# EAGLE design ibus_adapter (EAGLE 5.10)
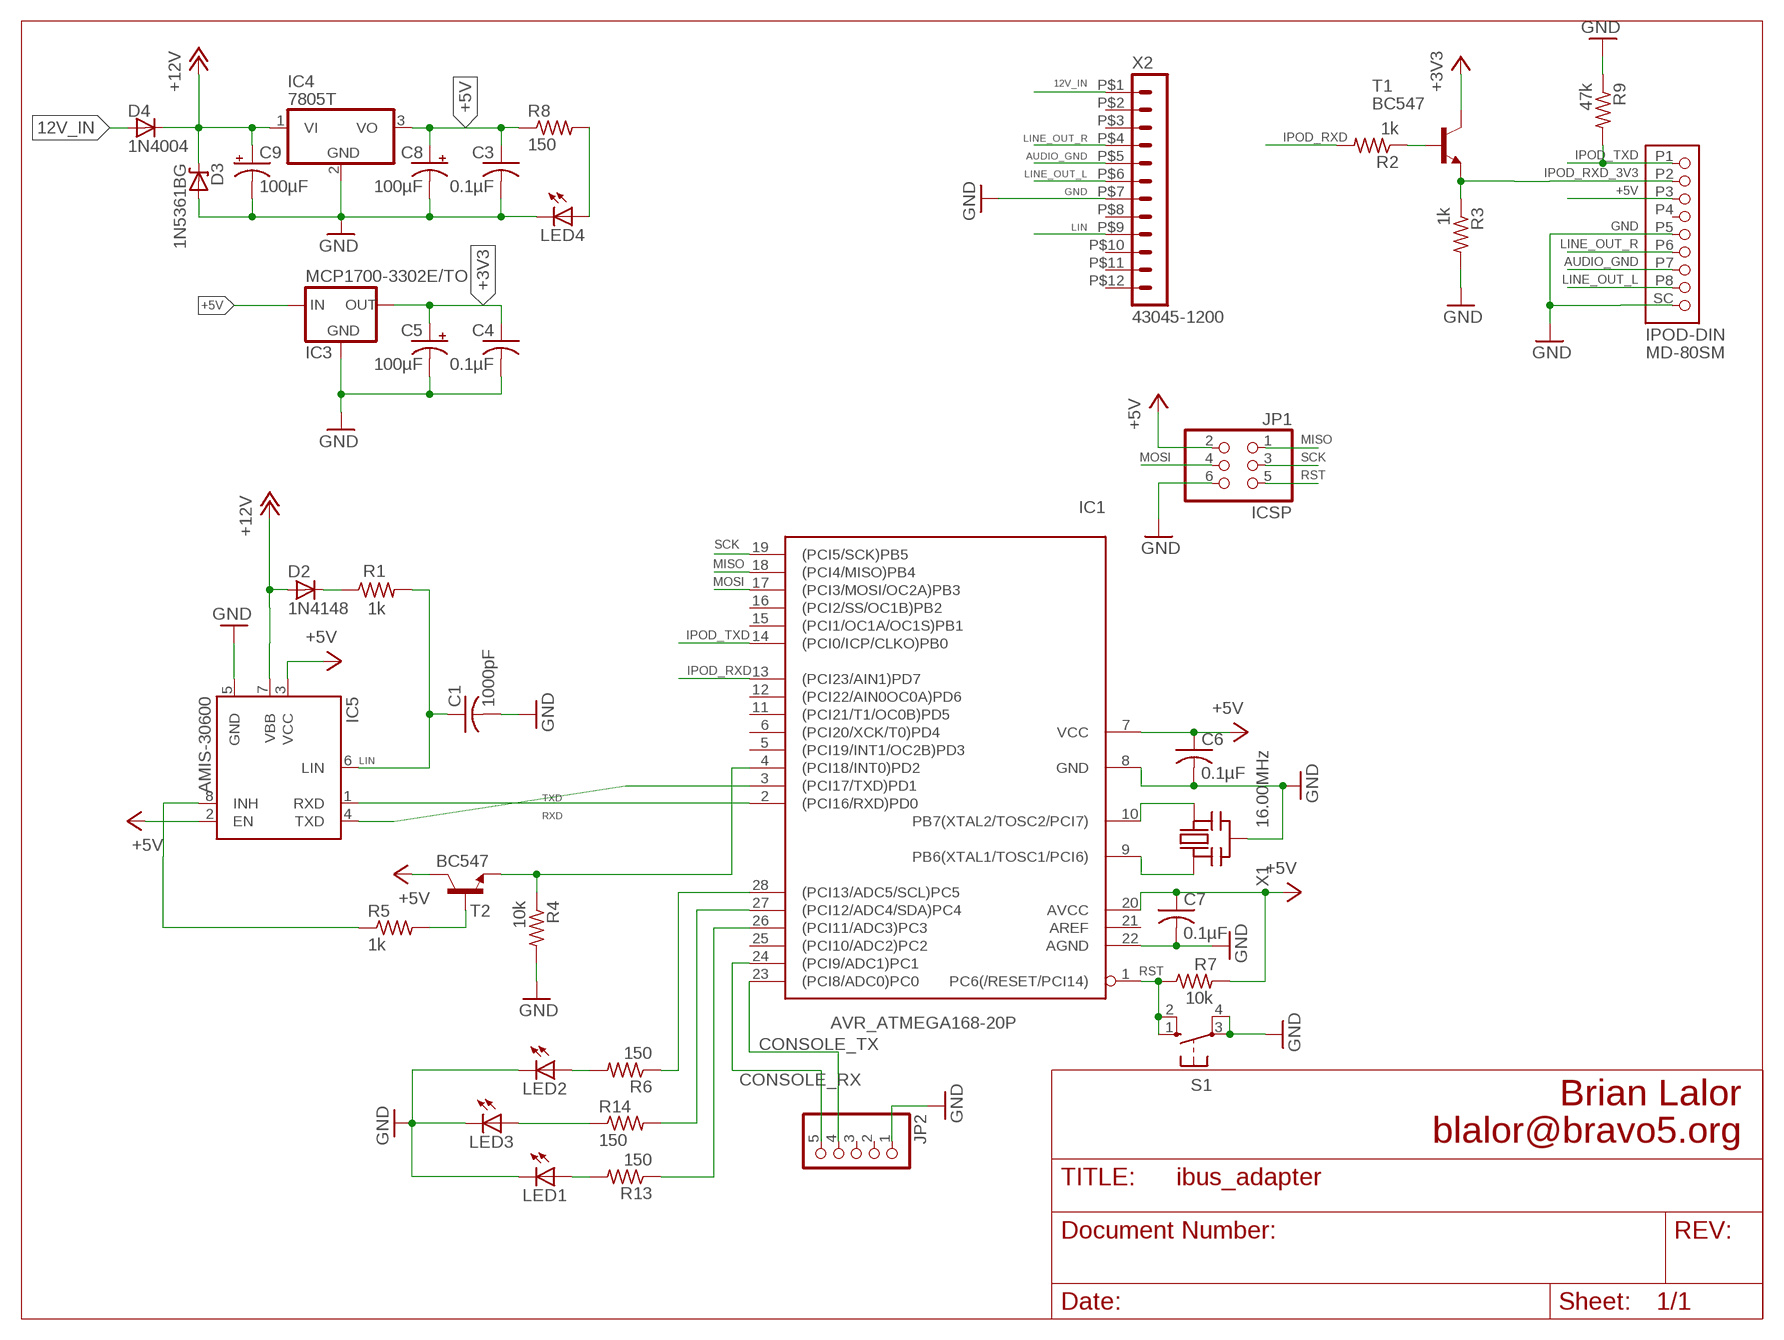
[diagram p0: schematic, sheet 1]

## Parts
C1  1000pF  C-US025-030X050  [C025-030X050]
C3  0.1µF  C-US025-025X050  [C025-025X050]
C4  0.1µF  C-US025-025X050  [C025-025X050]
C5  100µF  CPOL-USE2.5-5  [E2,5-5]
C6  0.1µF  C-US025-025X050  [C025-025X050]
C7  0.1µF  C-US025-025X050  [C025-025X050]
C8  100µF  CPOL-USE2.5-5  [E2,5-5]
C9  100µF  CPOL-USE3.5-8  [E3,5-8]
D2  1N4148  1N4148DO35-7  [DO35-7]
D3  1N5361BG  1N5365B  [SURMETIC_40]
D4  1N4004  [DO41-10]
IC1  AVR_ATMEGA168-20P  [AVR_DIL28-3]
IC3  MCP1700-3302E/TO  ULINK_MC1700  [ULINK_TO92]
IC4  7805T  [TO220H]
IC5  AMIS-30600  [SO-8]
IPOD-DIN  MD-80SM  MD-80SM(2)  [MD-80SM]
JP1  ICSP  PINHD-2X3  [2X03]
JP2  PINHD-1X5  [1X05]
LED1  LEDCHIP-LED0603  [CHIP-LED0603]
LED2  LEDCHIP-LED0603  [CHIP-LED0603]
LED3  LEDCHIP-LED0603  [CHIP-LED0603]
LED4  LEDCHIP-LED0603  [CHIP-LED0603]
R1  1k  R-US_0204/7  [0204/7]
R2  1k  R-US_0207/2V  [0207/2V]
R3  1k  R-US_0207/2V  [0207/2V]
R4  10k  R-US_0207/2V  [0207/2V]
R5  1k  R-US_0207/2V  [0207/2V]
R6  150  R-US_R0603  [R0603]
R7  10k  R-US_0207/10  [0207/10]
R8  150  R-US_R0603  [R0603]
R9  47k  R-US_0207/2V  [0207/2V]
R13  150  R-US_R0603  [R0603]
R14  150  R-US_R0603  [R0603]
S1  SWITCH-OMRON_10-XX  [SWITCH-OMRON_B3F-10XX]
T1  BC547  BC547A-NPN-TO92-EBC  [TO92-EBC]
T2  BC547  BC547A-NPN-TO92-EBC  [TO92-EBC]
X1  16.00MHz  DIGG_CERMOSCILL  [DIGG_CERM_OSC]
X2  43045-1200  HEADER_POS12_43045-1200  [43045-1200]

## Nets
12V_IN: D4.A X2.P$1
+3V3: C4.1 C5.+ IC3.3(OUT) T1.C
+5V: C3.1 C6.1 C7.1 C8.+ IC1.7(VCC) IC1.20(AVCC) IC3.2(IN) IC4.3(VO) IC5.2(EN) IC5.3(VCC) IPOD-DIN.P3 JP1.2 R7.2 R8.1 T2.C
+12V: C9.+ D2.A D3.K(C) D4.C IC4.1(VI) IC5.7(VBB)
AUDIO_GND: IPOD-DIN.P7 X2.P$5
CONSOLE_RX: IC1.24((PCI9/ADC1)PC1) JP2.5
CONSOLE_TX: IC1.23((PCI8/ADC0)PC0) JP2.4
GND: C1.2 C3.2 C4.2 C5.- C6.2 C7.2 C8.- C9.- D3.A IC1.8(GND) IC1.22(AGND) IC3.1(GND) IC4.2(GND) IC5.5(GND) IPOD-DIN.P5 IPOD-DIN.SC(SHIELD) JP1.6 JP2.1 LED1.C LED2.C LED3.C LED4.C R3.2 R4.2 R9.1 S1.3(P) S1.4(P1) X1.P$2(GND) X2.P$7
IPOD_RXD: IC1.13((PCI23/AIN1)PD7) R2.2
IPOD_RXD_3V3: IPOD-DIN.P2 R3.1 T1.E
IPOD_TXD: IC1.14((PCI0/ICP/CLKO)PB0) IPOD-DIN.P1 R9.2
LIN: C1.1 IC5.6(LIN) R1.2 X2.P$9
LIN_INH: IC1.4((PCI18/INT0)PD2) R4.1 T2.E
LINE_OUT_L: IPOD-DIN.P8 X2.P$6
LINE_OUT_R: IPOD-DIN.P6 X2.P$4
MISO: IC1.18((PCI4/MISO)PB4) JP1.1
MOSI: IC1.17((PCI3/MOSI/OC2A)PB3) JP1.4
N$1: IC1.10(PB7(XTAL2/TOSC2/PCI7)) X1.P$3(OUT)
N$2: IC1.28((PCI13/ADC5/SCL)PC5) R6.1
N$3: R5.2 T2.B
N$4: D2.C R1.1
N$5: R2.1 T1.B
N$6: IC5.8(INH) R5.1
N$7: IC1.27((PCI12/ADC4/SDA)PC4) R14.2
N$9: IC1.26((PCI11/ADC3)PC3) R13.1
N$10: LED3.A R14.1
N$11: IC1.9(PB6(XTAL1/TOSC1/PCI6)) X1.P$1(IN)
N$12: LED4.A R8.2
N$13: LED1.A R13.2
N$15: LED2.A R6.2
RST: IC1.1(PC6(/RESET/PCI14)) JP1.5 R7.1 S1.1(S) S1.2(S1)
RXD: IC1.2((PCI16/RXD)PD0) IC5.1(RXD)
SCK: IC1.19((PCI5/SCK)PB5) JP1.3
TXD: IC1.3((PCI17/TXD)PD1) IC5.4(TXD)
Unconnected: IC1.5((PCI19/INT1/OC2B)PD3) IC1.6((PCI20/XCK/T0)PD4) IC1.11((PCI21/T1/OC0B)PD5) IC1.12((PCI22/AIN0OC0A)PD6) IC1.15((PCI1/OC1A/OC1S)PB1) IC1.16((PCI2/SS/OC1B)PB2) IC1.21(AREF) IC1.25((PCI10/ADC2)PC2) IPOD-DIN.P4 JP2.2 JP2.3 X2.P$2 X2.P$3 X2.P$8 X2.P$10 X2.P$11 X2.P$12

## Notes on the sheet
- Brian Lalor
- blalor@bravo5.org

## Library data of the parts
C1 C3 C4 C6 C7 = rcl:C-US: CAPACITOR, American symbol
C5 C8 C9 = rcl:CPOL-US: POLARIZED CAPACITOR, American symbol
D2 = diode:1N4148: DIODE high speed (Philips)
D3 = my_lib1:1N5365B
D4 = diode:1N4004: DIODE general purpose rectifier, 1 A
IC1 = boarduino:AVR_ATMEGA168*P: MICROCONTROLLER 16 kBytes FLASH 1 kBytes SRAM 512 Bytes EEPROM USART 8-channel 10 bit ADC
IC3 = xbee:ULINK_MC1700: VOLTAGE REGULATOR
IC4 = linear:78*: Positive VOLTAGE REGULATOR Source: http://cache.national.com/ds/LM/LM78L05.pdf http://www.fairchildsemi.com/ds/LM/LM7805.pdf
IC5 = my_lib1:AMIS-30600
IPOD-DIN = my_lib1:MD-80SM(2)
JP1 = pinhead:PINHD-2X3: PIN HEADER
JP2 = pinhead:PINHD-1X5: PIN HEADER
LED1-LED4 = led:LED: LED OSRAM: - CHIPLED LG R971, LG N971, LY N971, LG Q971, LY Q971, LO R971, LY R971 LH N974, LH R974 LS Q976, LO Q976, LY Q976 LO Q996 - Hyper CHIPLED LW Q18S LB Q993, LB Q99A, LB R99A - SideLED LS A670, LO A670, LY A670, LG A670, LP A670 LB A673, LV A673, LT A673, LW A673 LH A674 LY A675 LS A676, LA A676, LO A676, LY A676, LW A676 LS A679, LY A679, LG A679 - Hyper Micro SIDELED® LS Y876, LA Y876, LO Y876, LY Y876 LT Y87S - SmartLED LW L88C, LW L88S LB L89C, LB L89S, LG L890 LS L89K, LO L89K, LY L89K LS L896, LA L896, LO L896, LY L896 - TOPLED LS T670, LO T670, LY T670, LG T670, LP T670 LSG T670, LSP T670, LSY T670, LOP T670, LYG T670 LG T671, LOG T671, LSG T671 LB T673, LV T673, LT T673, LW T673 LH T674 LS T676, LA T676, LO T676, LY T676, LB T676, LH T676, LSB T676, LW T676 LB T67C, LV T67C, LT T67C, LS T67K, LO T67K, LY T67K, LW E67C LS E67B, LA E67B, LO E67B, LY E67B, LB E67C, LV E67C, LT E67C LW T67C LS T679, LY T679, LG T679 LS T770, LO T770, LY T770, LG T770, LP T770 LB T773, LV T773, LT T773, LW T773 LH T774 LS E675, LA E675, LY E675, LS T675 LS T776, LA T776, LO T776, LY T776, LB T776 LHGB T686 LT T68C, LB T68C - Hyper Mini TOPLED® LB M676 - Mini TOPLED Santana® LG M470 LS M47K, LO M47K, LY M47K Source: http://www.osram.convergy.de LUXEON: - LUMILED® LXK2-PW12-R00, LXK2-PW12-S00, LXK2-PW14-U00, LXK2-PW14-V00 LXK2-PM12-R00, LXK2-PM12-S00, LXK2-PM14-U00 LXK2-PE12-Q00, LXK2-PE12-R00, LXK2-PE12-S00, LXK2-PE14-T00, LXK2-PE14-U00 LXK2-PB12-K00, LXK2-PB12-L00, LXK2-PB12-M00, LXK2-PB14-N00, LXK2-PB14-P00, LXK2-PB14-Q00 LXK2-PR12-L00, LXK2-PR12-M00, LXK2-PR14-Q00, LXK2-PR14-R00 LXK2-PD12-Q00, LXK2-PD12-R00, LXK2-PD12-S00 LXK2-PH12-R00, LXK2-PH12-S00 LXK2-PL12-P00, LXK2-PL12-Q00, LXK2-PL12-R00 Source: www.luxeon.com KINGBRIGHT: KA-3528ASYC Source: www.kingbright.com
R1-R9 R13 R14 = rcl:R-US_: RESISTOR, American symbol
S1 = boarduino:SWITCH-OMRON_10-XX: OMRON SWITCH
T1 T2 = transistor:*-NPN-: NPN Transistror BF959 corrected 2008.03.06
X1 = boarduino:DIGG_CERMOSCILL
X2 = con-molex-micro-fit-3_0:HEADER_POS12_?: Molex - Micro-Fit 3.0 Series connector, 3.00mm (0.118") pitch header, 12 positions.

## Net classes
0 default: width 0.406 mm
1 power: width 1.27 mm

## Board
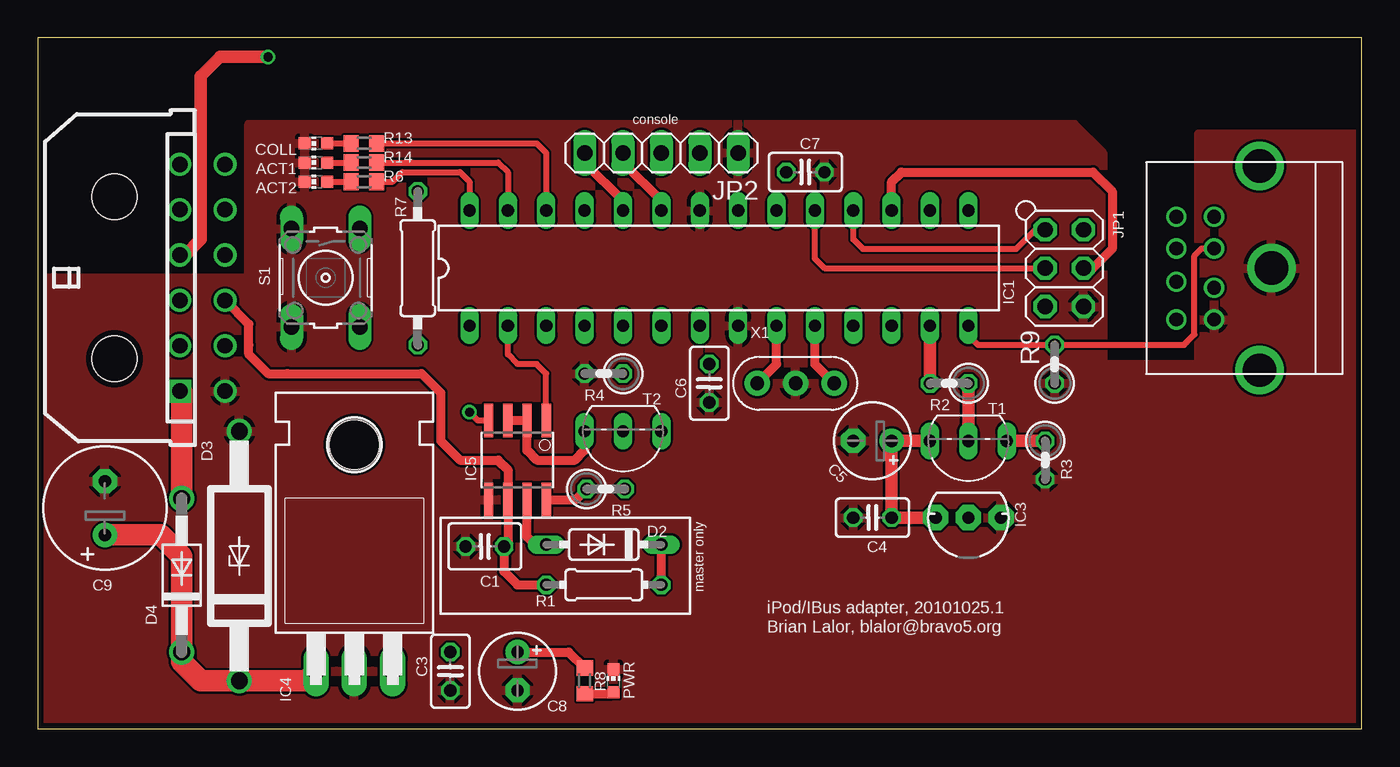
[diagram p1: board, top side]
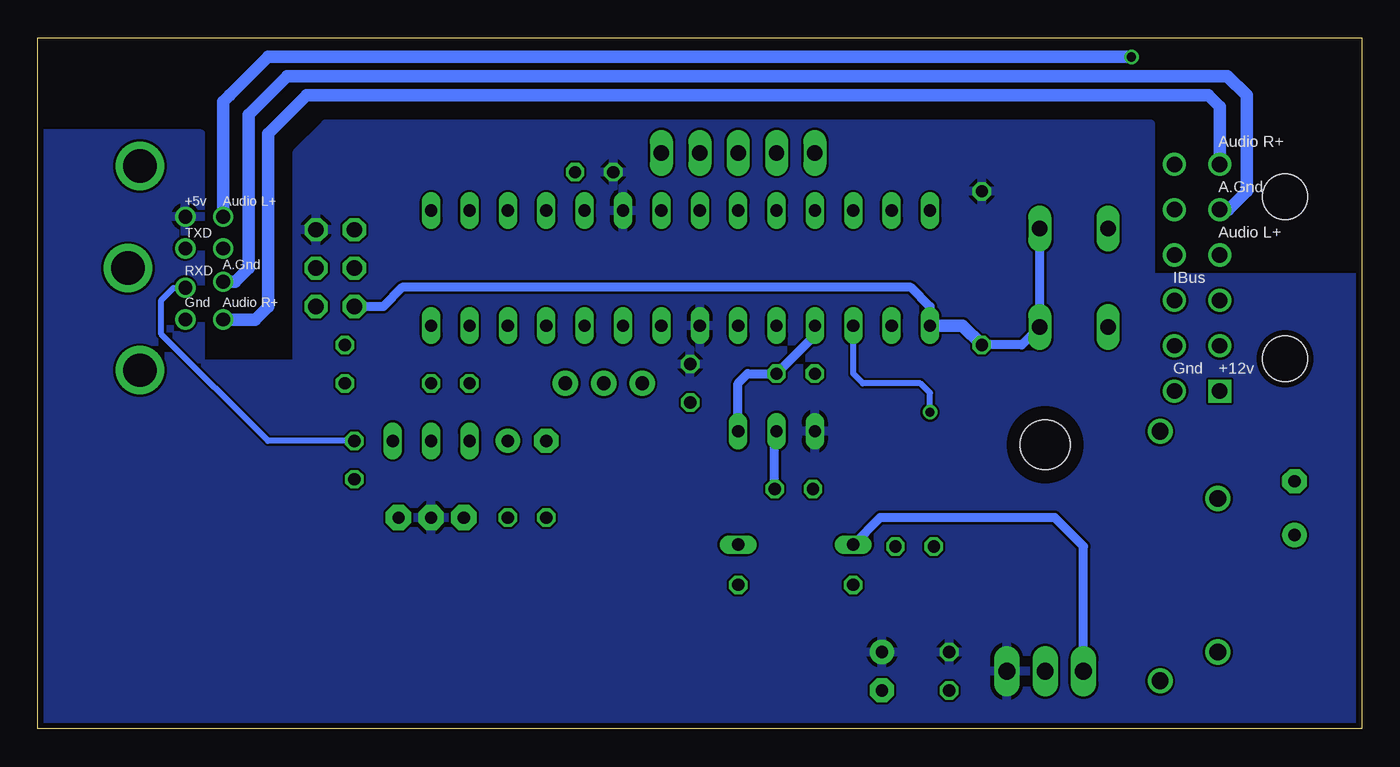
[diagram p2: board, bottom side, seen from below]

Size 87.63 x 45.72 mm. Coordinates in mm from the lower left corner, seen from the top.
Outline: 0,45.72 0,42.55 0,4.45 0,0 87.63,0 87.63,6.35 87.63,45.72 0,45.72
Copper layers (1*16): Top 0.0356mm / dielectric 1.5011mm / Bottom 0.0356mm
Design rules "LaenPCBOrder *": minimum track width 6mil, minimum drill 13mil, track to track 6mil, track to pad 6mil, pad to pad 6mil, via to via 6mil, smd to smd 6mil, copper to edge 15mil, drill to drill 6mil, minimum pad ring 7mil, minimum via ring 7mil, stop-mask expansion 4mil, vias tented up to drill 0mil, thermal gap 10mil

### Footprints (pad centres in the part's own frame; a part is rotated, then mirrored left to right if it is on the bottom)
C025-030X050 = drill 0.813 octagon: 1 -1.27,0; 2 1.27,0
C025-025X050 = drill 0.813 octagon: 1 -1.27,0; 2 1.27,0
E2,5-5 = drill 0.813 pad 1.6 round: + -1.27,0 | drill 0.813 pad 1.6 octagon: - 1.27,0
E3,5-8 = drill 0.813 pad 1.6 round: + -1.778,0 | drill 0.813 pad 1.6 octagon: - 1.778,0
DO35-7 = drill 0.813 long: A 3.81,0; C -3.81,0
SURMETIC_40 = drill 1.1 round: A -3.81,1.905; K 12.7,1.905
DO41-10 = drill 1.118 round: A 5.08,0; C -5.08,0
AVR_DIL28-3 = drill 0.813 long: 1 -16.51,-3.81; 2 -13.97,-3.81; 3 -11.43,-3.81; 4 -8.89,-3.81; 5 -6.35,-3.81; 6 -3.81,-3.81; 7 -1.27,-3.81; 8 1.27,-3.81; 9 3.81,-3.81; 10 6.35,-3.81; 11 8.89,-3.81; 12 11.43,-3.81; 13 13.97,-3.81; 14 16.51,-3.81; 15 16.51,3.81; 16 13.97,3.81; 17 11.43,3.81; 18 8.89,3.81; 19 6.35,3.81; 20 3.81,3.81; 21 1.27,3.81; 22 -1.27,3.81; 23 -3.81,3.81; 24 -6.35,3.81; 25 -8.89,3.81; 26 -11.43,3.81; 27 -13.97,3.81; 28 -16.51,3.81
ULINK_TO92 = drill 0.813 pad 1.676 octagon: 1 -2.159,0; 2 0,0; 3 2.159,0
TO220H = drill 1.118 long: 1 -2.54,-10.16; 2 0,-10.16; 3 2.54,-10.16 | hole 3.302: 0,4.826
SO-8 = smd 0.61 x 2.21: 1 -1.905,-2.616; 2 -0.635,-2.616; 3 0.635,-2.616; 4 1.905,-2.616; 5 1.905,2.616; 6 0.635,2.616; 7 -0.635,2.616; 8 -1.905,2.616
MD-80SM = drill 0.9 round: P1 -1.3,-8.5; P2 1.3,-8.5; P3 -3.4,-8.5; P4 -1.3,-11; P5 3.4,-8.5; P6 -3.4,-11; P7 0.9,-11; P8 3.4,-11 | drill 2.2 round: SC 0,-4.7; SL -6.75,-5.5; SR 6.75,-5.5
2X03 = drill 1.016 octagon: 1 -2.54,-1.27; 2 -2.54,1.27; 3 0,-1.27; 4 0,1.27; 5 2.54,-1.27; 6 2.54,1.27
1X05 = drill 1.016 long: 1 -5.08,0; 2 -2.54,0; 3 0,0; 4 2.54,0; 5 5.08,0
CHIP-LED0603 = smd 0.8 x 0.8: A 0,-0.75; C 0,0.75
0204/7 = drill 0.813 octagon: 1 -3.81,0; 2 3.81,0
0207/2V = drill 0.813 octagon: 1 -1.27,0; 2 1.27,0
R0603 = smd 1 x 1.1: 1 -0.85,0; 2 0.85,0
0207/10 = drill 0.813 octagon: 1 -5.08,0; 2 5.08,0
SWITCH-OMRON_B3F-10XX = drill 1.016 long: 1 -3.251,2.261; 2 3.251,2.261; 3 -3.251,-2.261; 4 3.251,-2.261
TO92-EBC = drill 0.813 long: B 0,-1.27; C 2.54,-1.27; E -2.54,-1.27
DIGG_CERM_OSC = drill 0.9 pad 1.676 round: P$1 -2.54,0; P$2 0,0; P$3 2.54,0
43045-1200 = drill 1.02 square: P$1 7.5,4.32 | drill 1.02 round: P$2 4.5,4.32; P$3 1.5,4.32; P$4 -1.5,4.32; P$5 -4.5,4.32; P$6 -7.5,4.32; P$7 7.5,7.32; P$8 4.5,7.32; P$9 1.5,7.32; P$10 -1.5,7.32; P$11 -4.5,7.32; P$12 -7.5,7.32 | hole 3: 5.35,0; -5.35,0

### Placement (x,y rotation side)
C1  29.59,12.06 180 top
C3  27.3,3.81 270 top
C4  55.24,13.97 180 top
C5  55.24,19.05 180 top
C6  44.45,22.86 270 top
C7  50.8,36.83 0 top
C8  31.75,3.81 270 top
C9  4.45,14.61 90 top
D2  37.47,12.19 180 top
D3  11.43,15.88 270 top
D4  9.53,10.16 90 top
IC1  45.09,30.48 0 top
IC3  61.59,13.97 180 top
IC4  20.95,13.97 0 top
IC5  31.75,17.78 180 top
IPOD-DIN  86.36,30.48 270 top
JP1  67.94,30.48 270 top
JP2  41.27,38.1 180 top
LED1  18.41,38.73 90 top
LED2  18.41,36.2 90 top
LED3  18.41,37.47 90 top
LED4  38.1,3.17 0 top
R1  37.47,9.53 180 top
R2  60.33,22.86 180 top
R3  66.67,17.78 270 top
R4  37.47,23.5 180 top
R5  37.59,15.88 0 top
R6  21.59,36.2 180 top
R7  25.15,30.48 90 top
R8  36.2,3.17 270 top
R9  67.31,24.13 90 top
R13  21.59,38.73 180 top
R14  21.59,37.47 0 top
S1  19.05,29.84 270 top
T1  61.59,17.78 180 top
T2  38.73,18.41 180 top
X1  50.16,22.86 0 top
X2  5.08,29.84 270 top

### Tracks (layer width: path | path; a pad name or v marks a point on that pad's centre or on a via)
12V_IN
  Top 1.422: X2.P$1 9.53,22.34 D4.A
+3V3
  Top 0.813: T1.C C5.+ C4.1 IC3.3
+5V
  Top 0.61: IC5.3 IC5.2 32.38,18.41 33.02,17.78 35.56,17.78 36.2,18.41 T2.C | C8.+ 35.14,5.08 R8.1
  pour Bottom: 70.48,38.1 70.48,24.13 76.83,24.13 76.83,39.37 87.63,39.37 87.63,0 0,0 0,29.84 13.97,29.84 13.97,40.01 68.58,40.01
+12V
  Top 0.406: D2.A 33.53,12.06
  Top 0.61: IC5.7 32.38,12.7 33.02,12.06 33.53,12.06 | D2.A 33.78,12.06
  Top 1.422: IC4.1 17.78,3.17 D3.K 10.79,3.17 9.53,4.45 D4.C 9.53,11.43 8.13,12.83 C9.+
  Bottom 0.61: IC4.1 18.41,12.06 20.32,13.97 31.88,13.97 D2.A
AUDIO_GND
  Bottom 0.813: IPOD-DIN.P7 74.56,29.58 73.66,30.48 73.66,38.1 73.66,40.64 71.12,43.18 68.58,43.18 15.24,43.18 8.89,43.18 7.62,41.91 7.62,35.56 8.84,34.34 X2.P$5
CONSOLE_RX
  Top 0.61: JP2.5 36.2,37.47 38.73,34.92 IC1.24
CONSOLE_TX
  Top 0.61: JP2.4 38.73,37.47 41.27,34.92 IC1.23
GND
  pour Top: 68.58,40.01 70.48,38.1 70.48,24.13 76.83,24.13 76.83,39.37 87.63,39.37 87.63,0 0,0 0,29.84 13.97,29.84 13.97,40.01
IPOD_RXD
  Top 0.813: R2.2 IC1.13
IPOD_RXD_3V3
  Top 0.813: T1.E R3.1
  Bottom 0.406: IPOD-DIN.P2 78.64,29.18 79.46,28.36 79.46,26.12 72.39,19.05 R3.1
IPOD_TXD
  Top 0.406: IPOD-DIN.P1 77.04,31.78 76.56,31.3 76.56,26.1 76.03,25.57 75.86,25.4 62.23,25.4 | IC1.14 61.59,26.04 62.23,25.4 | 62.23,25.4 R9.2
LIN
  Top 0.61: R1.2 31.75,9.53 30.86,10.41 C1.1 31.11,12.32 IC5.6 31.11,17.14 30.48,17.78 27.94,17.78 26.67,19.05 26.67,22.23 25.4,23.5 16.51,23.5 15.24,23.5 13.97,24.77 13.97,25.4 13.97,26.77 X2.P$9
LIN_INH
  Bottom 0.61: IC1.4 36.2,26.04 R4.1 40.64,23.5 41.27,22.86 T2.E
LINE_OUT_L
  Bottom 0.813: IPOD-DIN.P8 73.25,27.08 72.39,27.94 72.39,39.37 69.85,41.91 66.04,41.91 17.78,41.91 10.16,41.91 9.4,41.15 X2.P$6
LINE_OUT_R  (via drill 0.6)
  Top 0.813: X2.P$4 9.76,31.34 10.79,32.38 10.79,43.18 12.06,44.45 v15.24,44.45
  Bottom 0.813: v15.24,44.45 69.85,44.45 72.39,44.45 74.93,41.91 75.36,41.48 IPOD-DIN.P6
MISO
  Top 0.406: IC1.18 53.98,32.38 54.61,31.75 64.77,31.75 66.04,33.02 JP1.1
MOSI
  Top 0.61: IC1.17 56.52,36.2 57.15,36.83 69.85,36.83 71.12,35.56 71.12,31.75 69.85,30.48 JP1.4
N$1
  Top 0.61: X1.P$3 51.44,24.13 IC1.10
N$2
  Top 0.406: R6.1 23.5,36.2 24.13,36.83 27.94,36.83 28.57,36.2 IC1.28
N$3
  Bottom 0.61: R5.2 38.86,19.56 T2.B
N$4
  Top 0.61: R1.1 D2.C
N$5
  Top 0.813: T1.B R2.1
N$6
  Top 0.61: IC5.8 35.61,15.16 R5.1
N$7
  Top 0.406: R14.2 30.48,37.47 31.11,36.83 IC1.27
N$9
  Top 0.406: IC1.26 33.66,38.1 33.02,38.73 R13.1
N$10
  Top 0.406: LED3.A R14.1
N$11
  Top 0.61: X1.P$1 48.9,24.13 IC1.9
N$12
  Top 0.61: R8.2 38,2.33 LED4.A
N$13
  Top 0.406: LED1.A R13.2
N$15
  Top 0.406: LED2.A R6.2
RST
  Bottom 0.61: IC1.1 28.57,27.94 29.84,29.21 63.5,29.21 64.77,27.94 JP1.5 | S1.1 S1.2 22.5,25.4 R7.1
  Bottom 0.813: IC1.1 26.42,26.67 R7.1
RXD
  Top 0.406: IC1.2 31.11,24.77 31.75,24.13 33.02,24.13 33.66,23.5 IC5.1
SCK
  Top 0.406: IC1.19 51.44,31.11 52.07,30.48 JP1.3
TXD  (via drill 0.6)
  Top 0.406: IC5.4 29.13,20.4 v28.57,20.95
  Bottom 0.406: v28.57,20.95 28.57,22.23 29.21,22.86 33.02,22.86 33.66,23.5 IC1.3

### Text on the board
tNames: console | COLL | ACT1 | ACT2 | master only | iPod/IBus adapter, 20101025.1 | Brian Lalor, blalor@bravo5.org | PWR
bNames: Audio R+ | A.Gnd | Audio L+ | +5v | Audio L+ | TXD | IBus | A.Gnd | RXD | Audio R+ | Gnd | +12v | Gnd